# Altium schematic sheet Esquema NTC.SchDoc
size A4
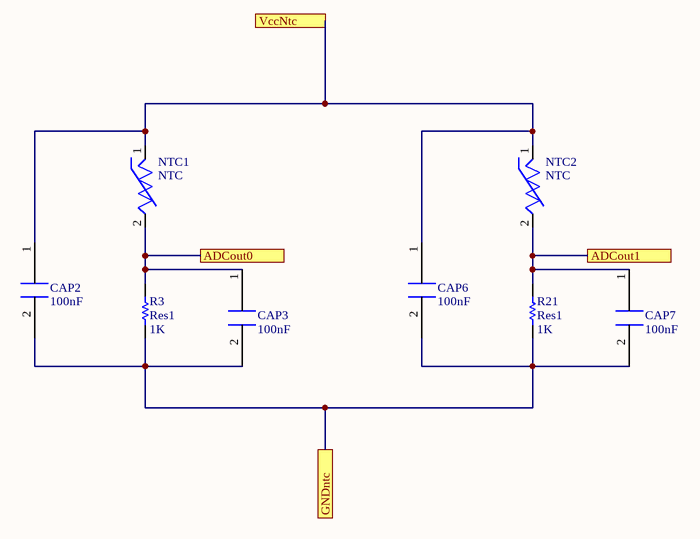
[diagram p0: Esquema NTC.SchDoc]

## Parts
CAP2  100nF  [Capacitor Eletro]
CAP3  100nF  [Capacitor Eletro]
CAP6  100nF  [Capacitor Eletro]
CAP7  100nF  [Capacitor Eletro]
NTC1  NTC  [NTC]
NTC2  NTC  [NTC]
R3  Res1  value 1K  [AXIAL-0.3]
R21  Res1  value 1K  [AXIAL-0.3]

## Ports
ADCout0, ADCout1, GNDntc, VccNtc

## Nets
ADCout0: CAP3.1 NTC1.2 R3.2 ; port ADCout0
ADCout1: CAP7.1 NTC2.2 R21.2 ; port ADCout1
GNDntc: CAP2.2 CAP3.2 CAP6.2 CAP7.2 R3.1 R21.1 ; port GNDntc
VccNtc: CAP2.1 CAP6.1 NTC1.1 NTC2.1 ; port VccNtc

## Library data of the parts
CAP2 CAP3 CAP6 CAP7 = 33pF: Condensador
R3 R21 = Res1: Resistor; Published: 8-Jun-2000; LatestRevisionDate: 17-Jul-2002; LatestRevisionNote: Re-released for DXP Platform.; PackageReference: AXIAL-0.3; Publisher: Altium Limited; PackageDescription: Axial Device, Thru-Hole; 2 Leads; 0.3 in Pin Spacing